# EasyEDA schematic Принципиальная схема.json

## Sheets
1 oscilloscope: TITLE: course-project-oscilloscope; REV: 1.0; Date: 2025-03-16; Sheet: 1/1; Drawn By: Валюк А 3-КСК-22
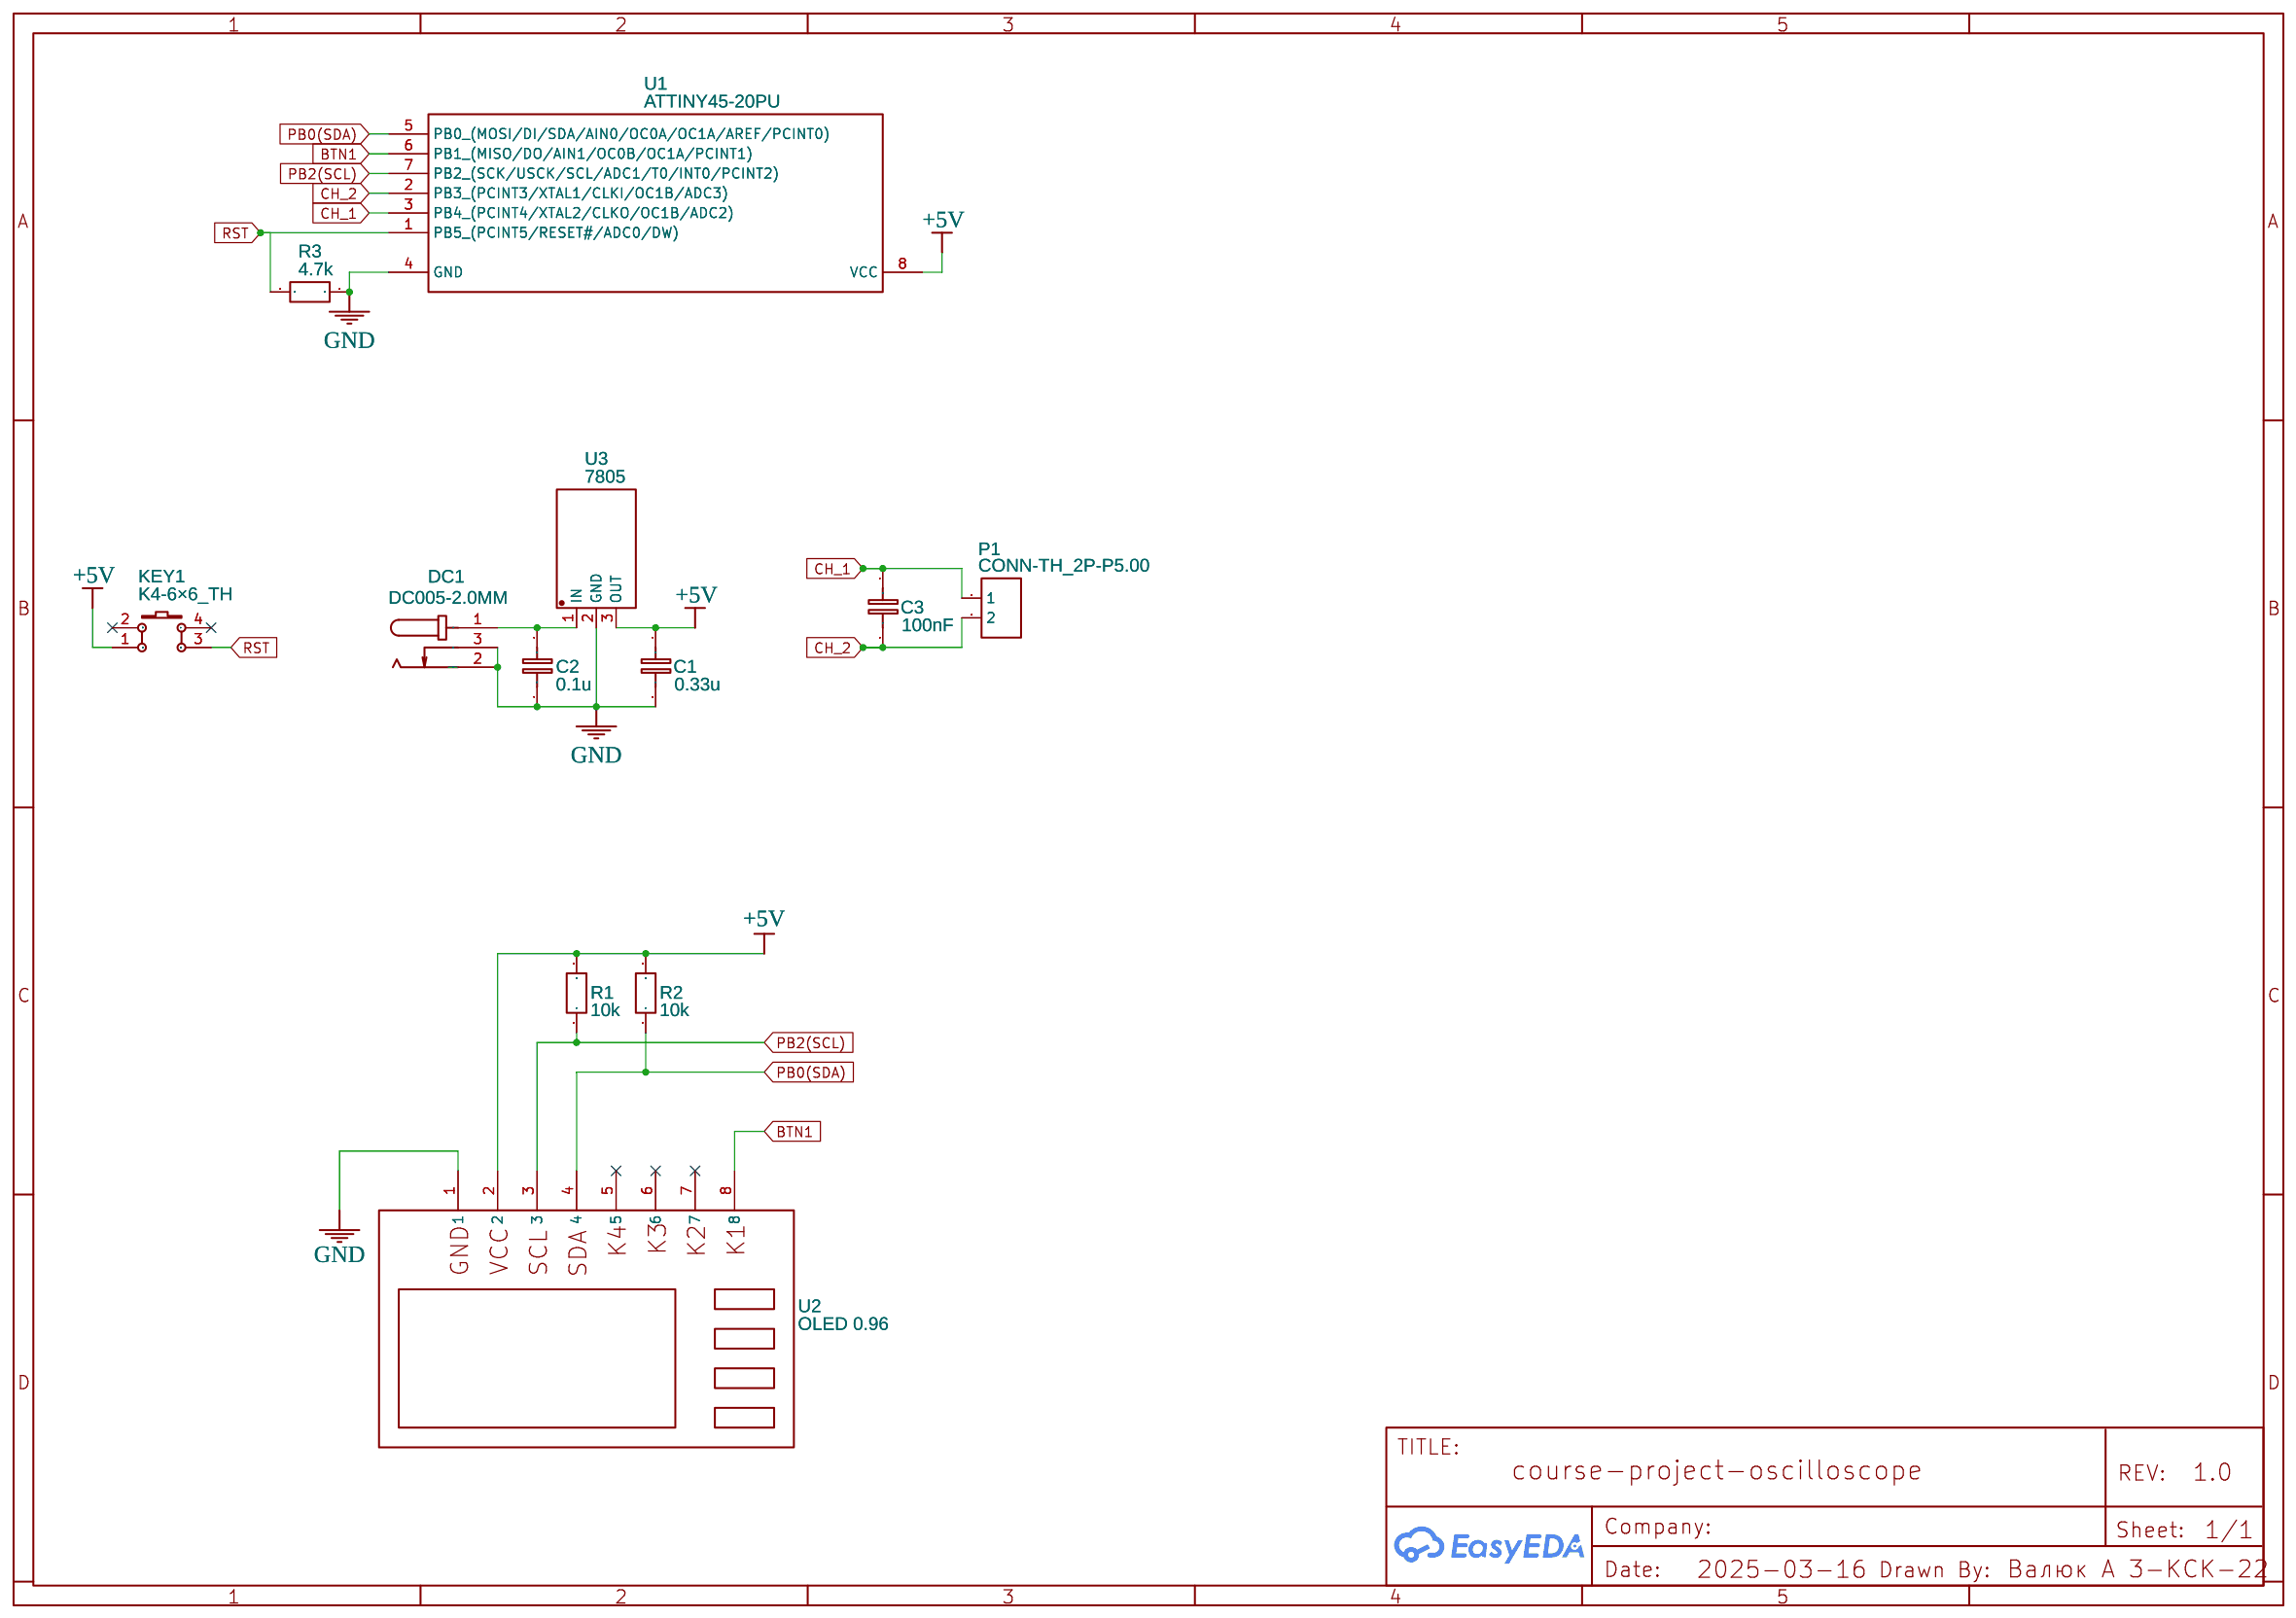
[diagram p0: oscilloscope]
2 OLED: TITLE: OLED 0.96
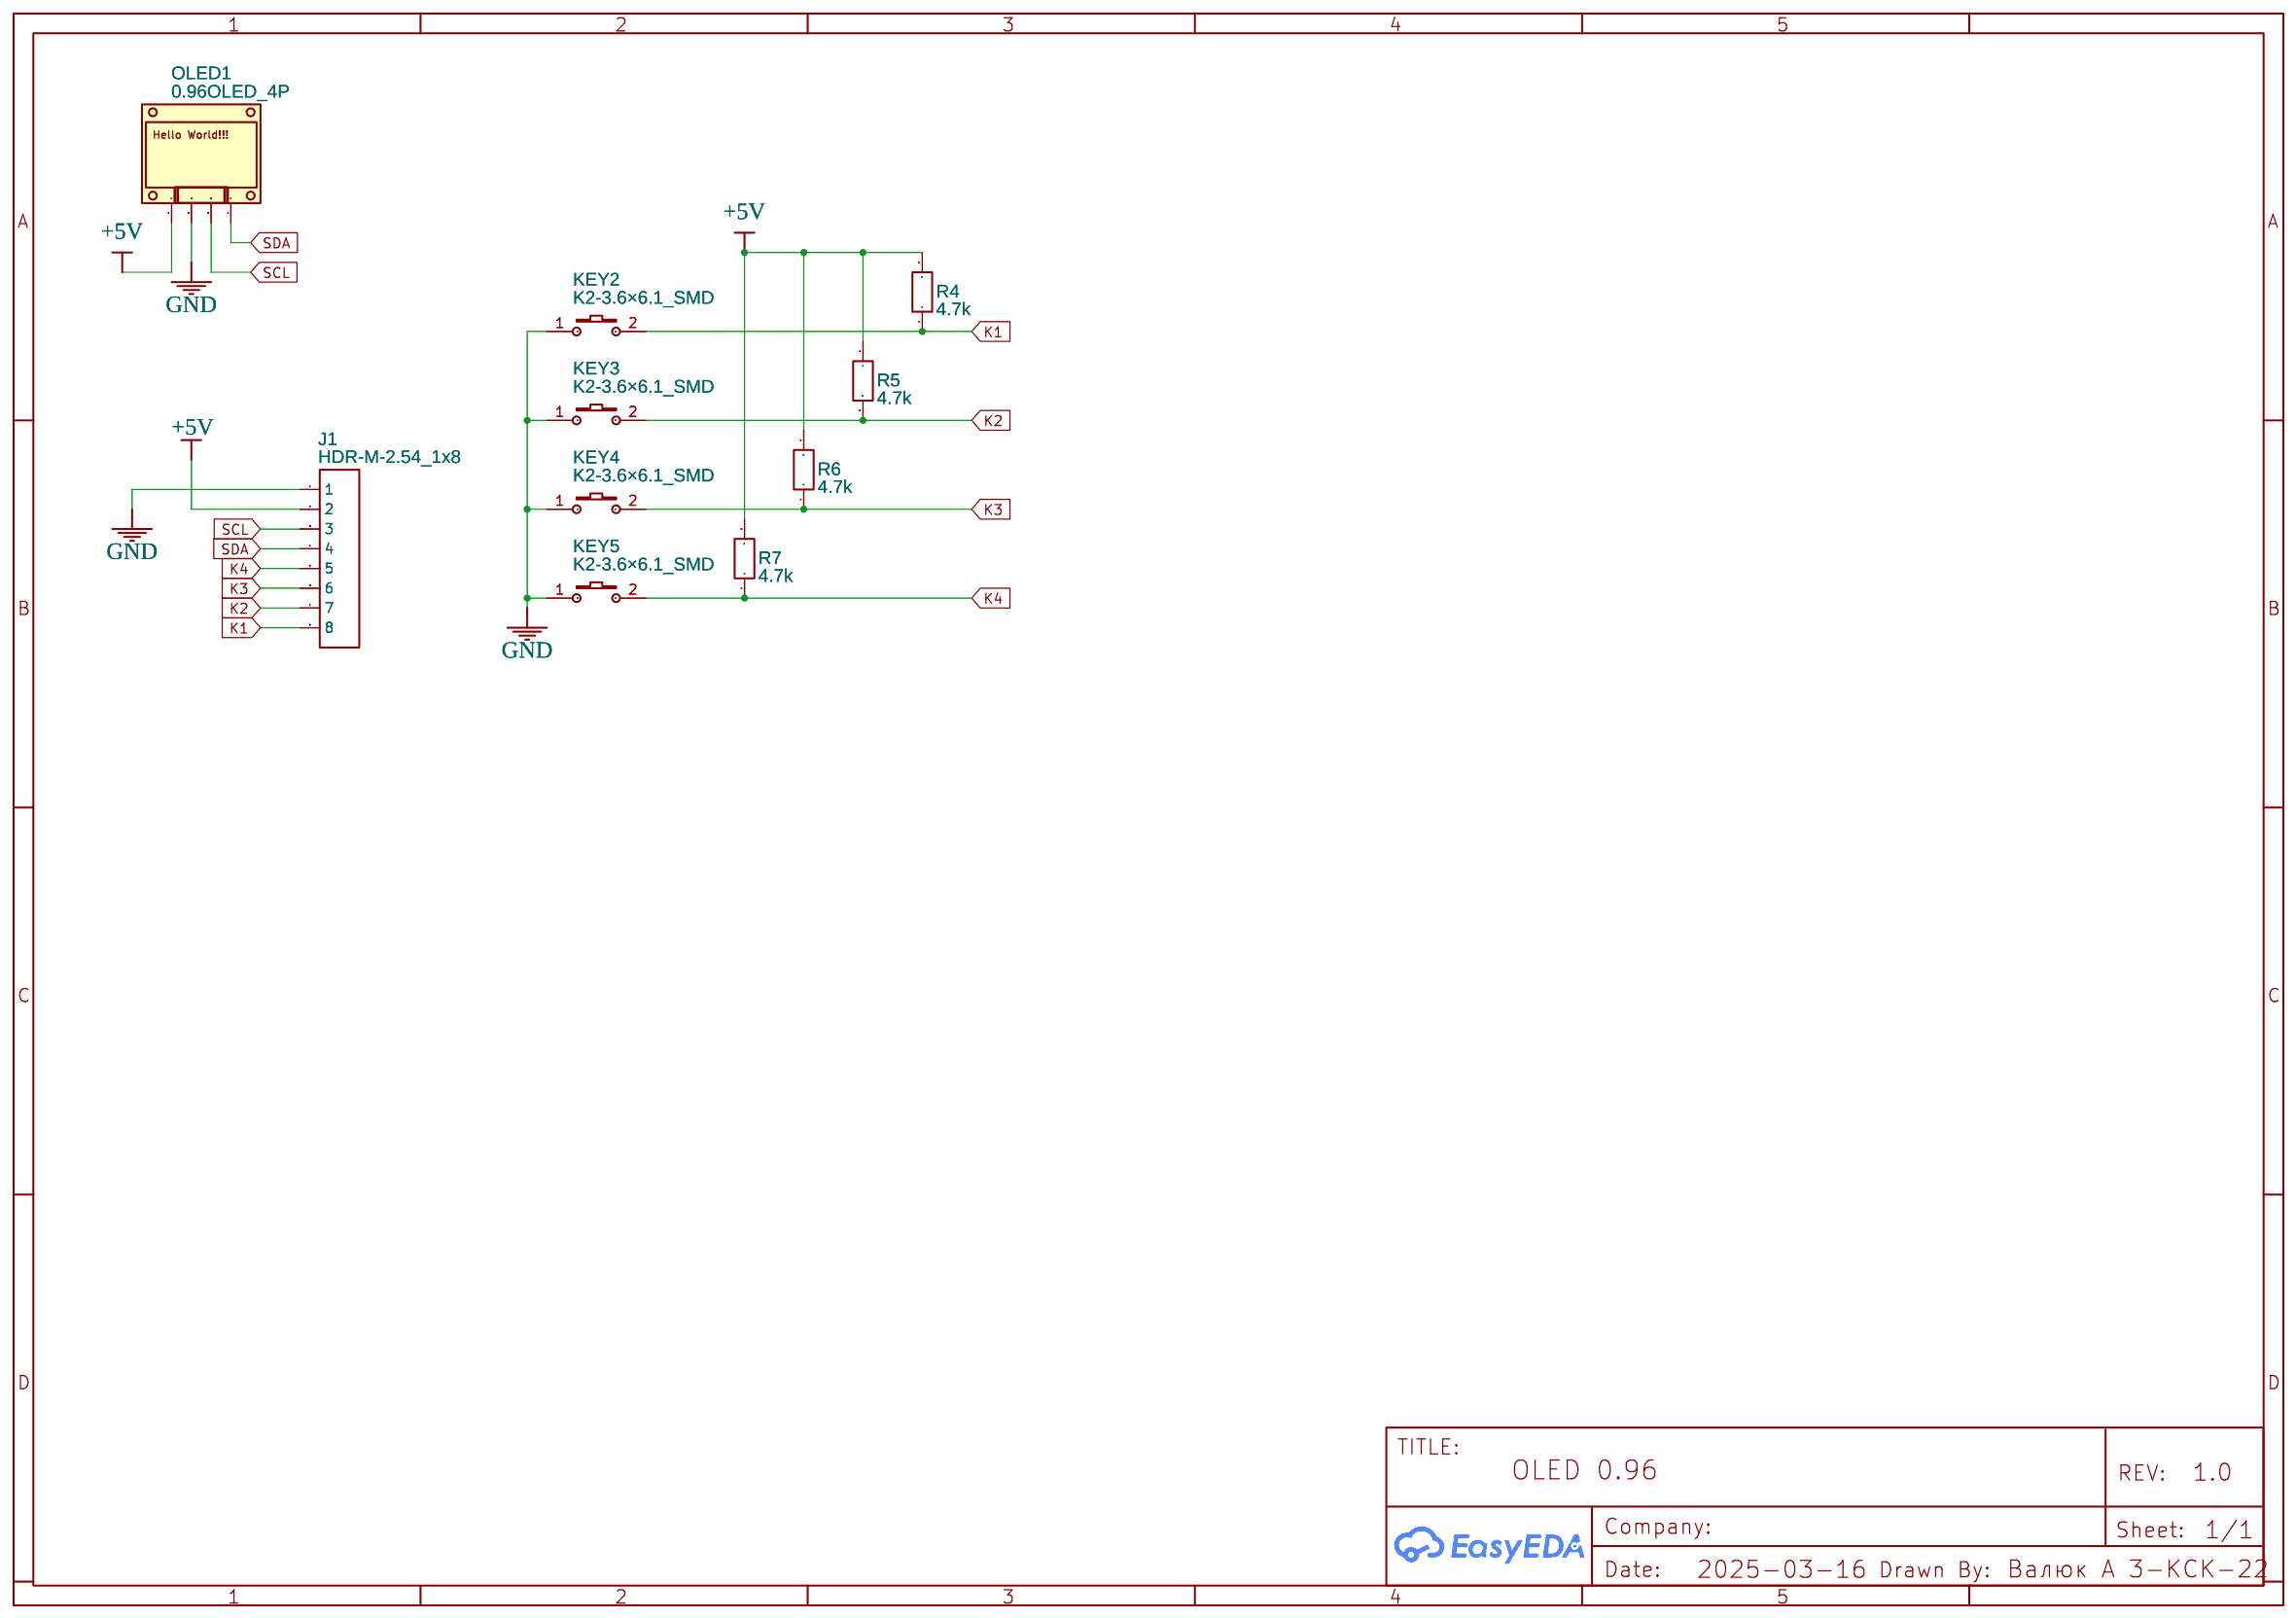
[diagram p1: OLED]

## Parts
sheet OLED
J1  HDR-M-2.54_1x8  [HDR-M-2.54_1X8]
KEY2  K2-3.6×6.1_SMD  [KEY-SMD_2P-L6.2-W3.6-LS8.0]
KEY3  K2-3.6×6.1_SMD  [KEY-SMD_2P-L6.2-W3.6-LS8.0]
KEY4  K2-3.6×6.1_SMD  [KEY-SMD_2P-L6.2-W3.6-LS8.0]
KEY5  K2-3.6×6.1_SMD  [KEY-SMD_2P-L6.2-W3.6-LS8.0]
OLED1  0.96OLED_4P  [0.96OLED_4P]
R4  4.7k  [R0603]
R5  4.7k  [R0603]
R6  4.7k  [R0603]
R7  4.7k  [R0603]
sheet oscilloscope
C1  0.33u  [RAD-0.1]
C2  0.1u  [RAD-0.1]
C3  100nF  [RAD-0.1]
DC1  DC005-2.0MM  [DC-IN-TH_DC005]
KEY1  K4-6×6_TH  [KEY-TH_4P-L6.0-W6.0-P4.50-LS6.5]
P1  CONN-TH_2P-P5.00  [CONN-TH_2P-P5.00]
R1  10k  [R_AXIAL-0.3]
R2  10k  [R_AXIAL-0.3]
R3  4.7k  [R_AXIAL-0.3]
U1  ATTINY45-20PU  [PDIP-8_L9.3-W6.4-P2.54-LS7.6-BL]
U2  OLED 0.96  [OLED]
U3  7805  [TO-220-3_L10.0-W4.5-P2.54-L]

## Library data of the parts
J1 = HDR-M-2.54_1x8: Supplier Part: C190820; Supplier: LCSC; Contributor: LCEDA_Lib
KEY2-KEY5 = K2-3.6×6.1_SMD: Supplier Part: C118141; Supplier: LCSC; Manufacturer Part: K2-1107ST-A4SW-06; Contributor: LCEDA_Lib; 制造商: 韩国韩荣
OLED1 = 0.96OLED_4P: Supplier: LCSC; Contributor: LCEDA_Lib
R4-R7 = R_0603_EU: Contributor: LCEDA_Lib
C1-C3 = C_RAD-0.1_EU: Contributor: LCEDA_Lib
DC1 = DC005-2.0MM: Supplier: LCSC; Manufacturer: SOFNG; Supplier Part: C111567
KEY1 = K4-6×6_TH: Supplier: LCSC; Supplier Part: C136684; Manufacturer: 韩国韩荣; Manufacturer Part: K2-1102DP-E4SW-04; Contributor: LCEDA_Lib
P1 = CONN-TH_2P-P5.00: Supplier: LCSC; Contributor: LCEDA_Lib
R1-R3 = R_AXIAL-0.3_EU: Contributor: LCEDA_Lib
U1 = ATTINY45-20PU: Contributor: LCSC; Supplier: LCSC; Manufacturer: MICROCHIP(美国微芯); Supplier Part: C152181; JLCPCB Part Class: Extended Part
U2 = OLED 0.96: Contributor: andrewalyuk
U3 = 7805: Contributor: LCSC; Supplier: LCSC; Supplier Part: C305416; Manufacturer: BLUE ROCKET(蓝箭); JLCPCB Part Class: Extended Part

## Nets
+5V: C1.1 J1.2 KEY1.1 OLED1.1 R1.2 R2.2 R4.2 R5.1 R6.2 R7.2 U1.8(VCC) U2.2 U3.3(OUT)
GND: C1.2 C2.2 DC1.2 DC1.3 J1.1 KEY2.1 KEY3.1 KEY4.1 KEY5.1 OLED1.2 R3.1 U1.4(GND) U2.1 U3.2(GND)
BTN1: U1.6(PB1 (MISO/DO/AIN1/OC0B/OC1A/PCINT1)) U2.8
CH_1: C3.1 P1.1 U1.3(PB4 (PCINT4/XTAL2/CLKO/OC1B/ADC2))
CH_2: C3.2 P1.2 U1.2(PB3 (PCINT3/XTAL1/CLKI/OC1B/ADC3))
K1: J1.8 KEY2.2 R4.1
K2: J1.7 KEY3.2 R5.2
K3: J1.6 KEY4.2 R6.1
K4: J1.5 KEY5.2 R7.1
PB0(SDA): R2.1 U1.5(PB0 (MOSI/DI/SDA/AIN0/OC0A/OC1A/AREF/PCINT0)) U2.4
PB2(SCL): R1.1 U1.7(PB2 (SCK/USCK/SCL/ADC1/T0/INT0/PCINT2)) U2.3
RST: KEY1.3 R3.2 U1.1(PB5 (PCINT5/RESET#/ADC0/DW))
SCL: J1.3 OLED1.3
SDA: J1.4 OLED1.4
Net-(C2-1): C2.1 DC1.1 U3.1(IN)

Not connected (* = marked no-connect by the designer): KEY1 2* 4*; U2 5* 6* 7*
